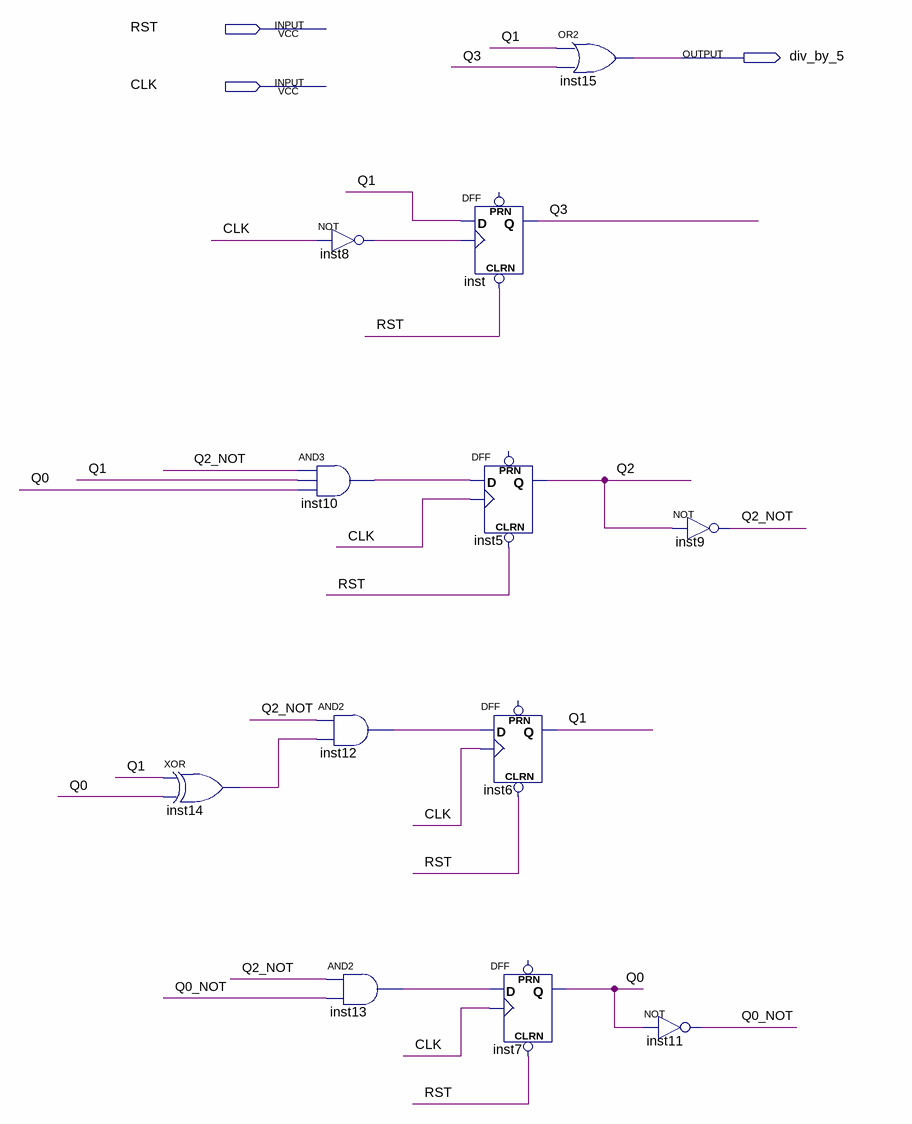
[diagram p0: schematic sheet]
// Quartus schematic divby5.bdf as structural Verilog: 12 symbols, 3 pins
module divby5 (
  input  RST,
  input  CLK,
  output div_by_5
);

  wire inst8_out, inst10_out, inst12_out, inst13_out, inst14_out, Q0, Q0_NOT, Q1, Q2, Q2_NOT, Q3;

  xor inst14 (inst14_out, Q1, Q0);
  not inst8 (inst8_out, CLK);
  and inst10 (inst10_out, Q2_NOT, Q1, Q0);
  and inst12 (inst12_out, Q2_NOT, inst14_out);
  and inst13 (inst13_out, Q2_NOT, Q0_NOT);
  DFF inst (.CLRN(RST), .CLK(inst8_out), .D(Q1), .Q(Q3));  // open: PRN
  DFF inst5 (.CLRN(RST), .CLK(CLK), .D(inst10_out), .Q(Q2));  // open: PRN
  DFF inst6 (.CLRN(RST), .CLK(CLK), .D(inst12_out), .Q(Q1));  // open: PRN
  DFF inst7 (.CLRN(RST), .CLK(CLK), .D(inst13_out), .Q(Q0));  // open: PRN
  or inst15 (div_by_5, Q1, Q3);
  not inst11 (Q0_NOT, Q0);
  not inst9 (Q2_NOT, Q2);
endmodule
